# Altium schematic sheet LPCB234 - 1 WIRE DRIVER.SchDoc
size A3; Address1: Factory 10; Address2: 9-13 Dingley Avenue, Dandeong, VICTORIA 3175, AUSTRALIA; DocumentNumber: 2; Revision: 1; SheetNumber: 2; SheetTotal: 10; Lockie__PCB_SUB_ASSEMBLY: 1 Wire; Lockie__PCB_ASSEMBLY: Main; Lockie__LDL: LPCB234; Lockie__PCB_DESCRIPTION: RM4 Power Node
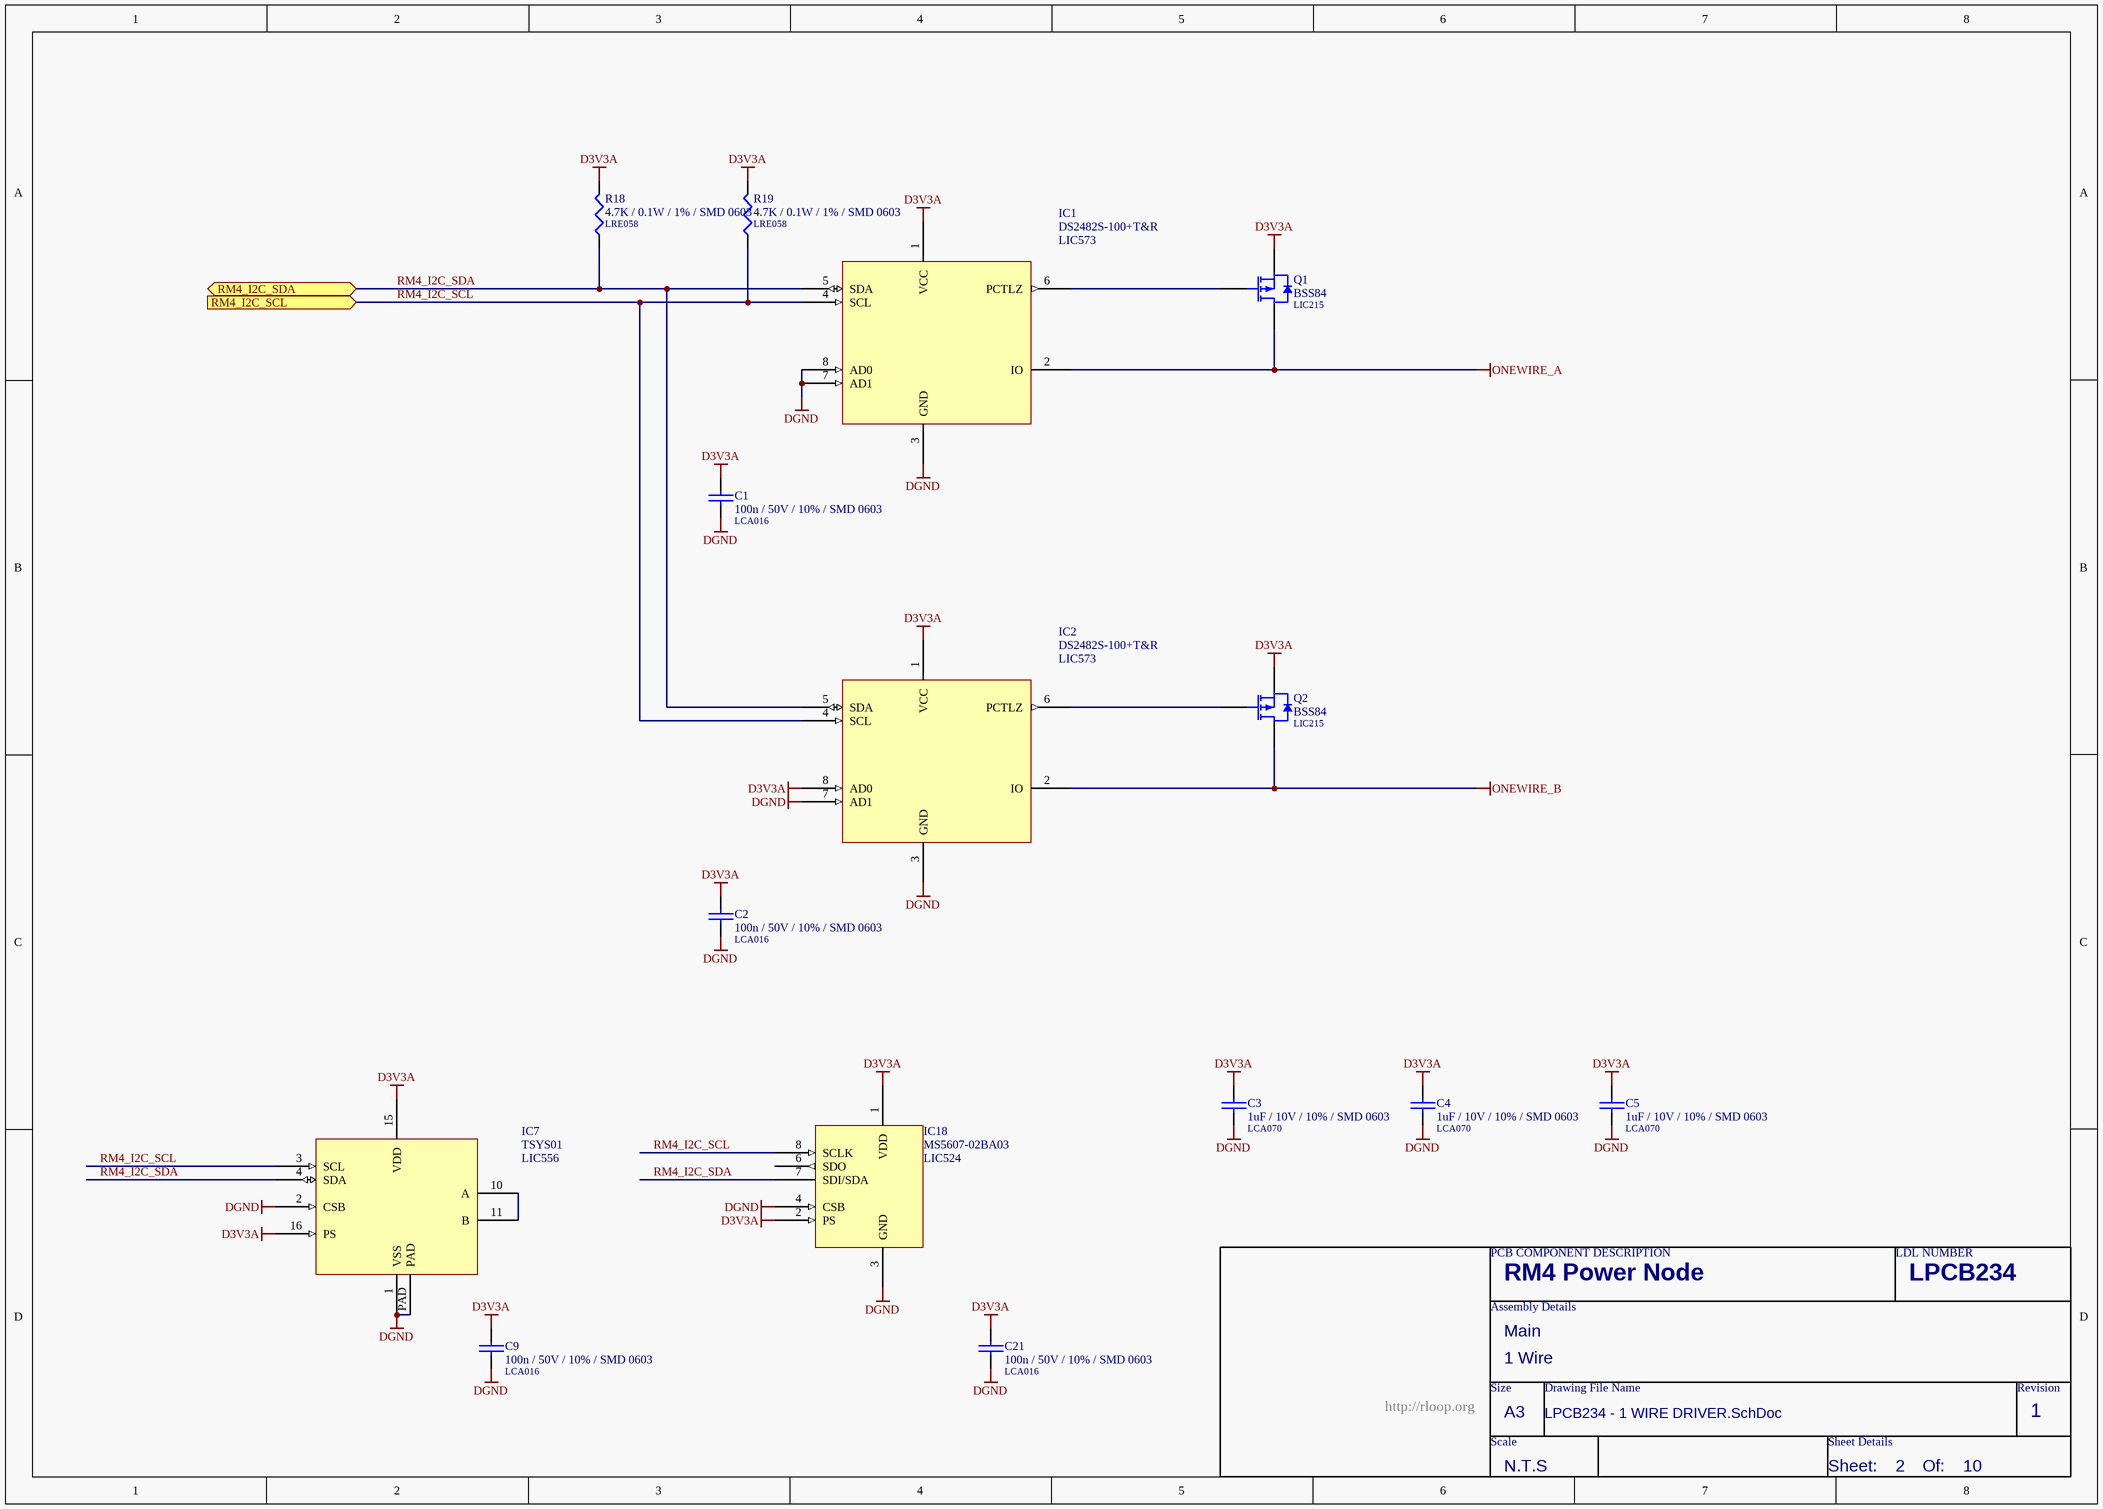
[diagram p0: LPCB234 - 1 WIRE DRIVER.SchDoc]

## Parts
C1  100n / 50V / 10% / SMD 0603  LDL_NUMBER: LCA016  [LFP011__CC1608-0603-IPC7351_B]
C2  100n / 50V / 10% / SMD 0603  LDL_NUMBER: LCA016  [LFP011__CC1608-0603-IPC7351_B]
C3  1uF / 10V / 10% / SMD 0603  LDL_NUMBER: LCA070  [LFP011__CC1608-0603-IPC7351_B]
C4  1uF / 10V / 10% / SMD 0603  LDL_NUMBER: LCA070  [LFP011__CC1608-0603-IPC7351_B]
C5  1uF / 10V / 10% / SMD 0603  LDL_NUMBER: LCA070  [LFP011__CC1608-0603-IPC7351_B]
C9  100n / 50V / 10% / SMD 0603  LDL_NUMBER: LCA016  [LFP011__CC1608-0603-IPC7351_B]
C21  100n / 50V / 10% / SMD 0603  LDL_NUMBER: LCA016  [LFP011__CC1608-0603-IPC7351_B]
IC1  DS2482S-100+T&R  LDL_NUMBER: LIC573  [LFP069__R-8G]
IC2  DS2482S-100+T&R  LDL_NUMBER: LIC573  [LFP069__R-8G]
IC7  TSYS01  LDL_NUMBER: LIC556  [LFP135__QFN65P400X400X80_HS-17M]
IC18  MS5607-02BA03  LDL_NUMBER: LIC524  [LFP140__QFN8]
Q1  BSS84  LDL_NUMBER: LIC215  [LFP021__SOT23]
Q2  BSS84  LDL_NUMBER: LIC215  [LFP021__SOT23]
R18  4.7K / 0.1W / 1% / SMD 0603  LDL_NUMBER: LRE058  [LFP020__CR1608-0603-IPC7351_B]
R19  4.7K / 0.1W / 1% / SMD 0603  LDL_NUMBER: LRE058  [LFP020__CR1608-0603-IPC7351_B]

## Ports
RM4_I2C_SCL (in), RM4_I2C_SDA (bidir)

## Nets
D3V3A: C1.1 C2.1 C3.1 C4.1 C5.1 C9.1 C21.1 IC1.1(VCC) IC2.1(VCC) IC2.8(AD0) IC7.15(VDD) IC7.16(PS) IC18.1(VDD) IC18.2(PS) Q1.2(S) Q2.2(S) R18.2 R19.2
DGND: C1.2 C2.2 C3.2 C4.2 C5.2 C9.2 C21.2 IC1.3(GND) IC1.7(AD1) IC1.8(AD0) IC2.3(GND) IC2.7(AD1) IC7.1(VSS) IC7.2(CSB) IC7.PAD IC18.3(GND) IC18.4(CSB)
ONEWIRE_A: IC1.2(IO) Q1.3(D)
ONEWIRE_B: IC2.2(IO) Q2.3(D)
RM4_I2C_SCL: IC1.4(SCL) IC2.4(SCL) IC7.3(SCL) IC18.8(SCLK) R19.1 ; port RM4_I2C_SCL
RM4_I2C_SDA: IC1.5(SDA) IC2.5(SDA) IC7.4(SDA) IC18.7(SDI/SDA) R18.1 ; port RM4_I2C_SDA
NetIC1_6: IC1.6(PCTLZ) Q1.1(G)
NetIC2_6: IC2.6(PCTLZ) Q2.1(G)
NetIC7_10: IC7.10(A) IC7.11(B)

Not connected (* = marked no-connect by the designer): IC18 6(SDO)

## Notes on the sheet
- PCB COMPONENT DESCRIPTION
- LDL NUMBER
- Assembly Details
- Size
- Drawing File Name
- Revision
- http://rloop.org
- Scale
- A3
- Sheet Details
- N.T.S
- Sheet:
- Of:

## Library data of the parts
C1 C2 C9 C21 = 100n / 50V / 10% / SMD 0603: Capacitor, Ceramic Chip, 100nF (0.1uF), 50V, 5%, SMD 0603 [LCA016]; FMEDA__OPERATING__VOLTAGE_MIN: 0; FMEDA__OPERATING__VOLTAGE_MAX: 3.3; FMEDA__OPERATING__TEMP_MIN: -20; FMEDA__OPERATING__TEMP_TYP: 27; FMEDA__OPERATING__TEMP_MAX: 50; FMEDA__CHANNEL: COM; Value: 100n; FMEDA__FUNCTION_IN_SYSTEM: *; FMEDA__OPERATING__VOLTAGE_TYP: 3.3
C3-C5 = 1uF / 10V / 10% / SMD 0603: Capacitor, Ceramic Chip, 1uF, 10V, SMD 0603 [LCA070]; Value: 1u; FMEDA__OPERATING__VOLTAGE_MAX: 3.3; FMEDA__OPERATING__VOLTAGE_MIN: 0; FMEDA__OPERATING__TEMP_MAX: 50; FMEDA__OPERATING__TEMP_MIN: -20; FMEDA__OPERATING__TEMP_TYP: 27; FMEDA__CHANNEL: COM; FMEDA__OPERATING__VOLTAGE_TYP: 3.3; FMEDA__FUNCTION_IN_SYSTEM: *
IC1 IC2 = DS2482S-100+T&R: IC, I2C to 1 Wire Bridge, SMD SOIC8
IC7 = TSYS01: IC, Digital Temp Sensor, SMD QFN16 [LIC556]
IC18 = MS5607-02BA03: IC, Pressure Sensor IC, SMD QFN8 [LIC524]
Q1 Q2 = BSS84: FET, P Channel, Logic Level, SMD SOT23 [LIC215]; FMEDA__OPERATING__TEMP_MAX: 50; FMEDA__OPERATING__TEMP_MIN: -20; FMEDA__OPERATING__TEMP_TYP: 27; FMEDA__CHANNEL: COM
R18 R19 = 4.7K / 0.1W / 1% / SMD 0603: Resistor, Ceramic Chip, 4K7, 0.1W, 1%, SMD 0603 [LRE058]; FMEDA__OPERATING__POWER_MAX: 0; FMEDA__OPERATING__TEMP_MAX: 50; FMEDA__OPERATING__TEMP_MIN: -20; FMEDA__OPERATING__TEMP_TYP: 27; FMEDA__CHANNEL: COM; VALUE: 4.7K; FMEDA__OPERATING__POWER_MIN: 0; FMEDA__OPERATING__VOLTAGE_MAX: 0; FMEDA__OPERATING__VOLTAGE_MIN: 0; FMEDA__OPERATING__VOLTAGE_TYP: 0; FMEDA__FUNCTION_IN_SYSTEM: *